# EAGLE schematic iv4_4lw_2.0 (EAGLE 4.91)
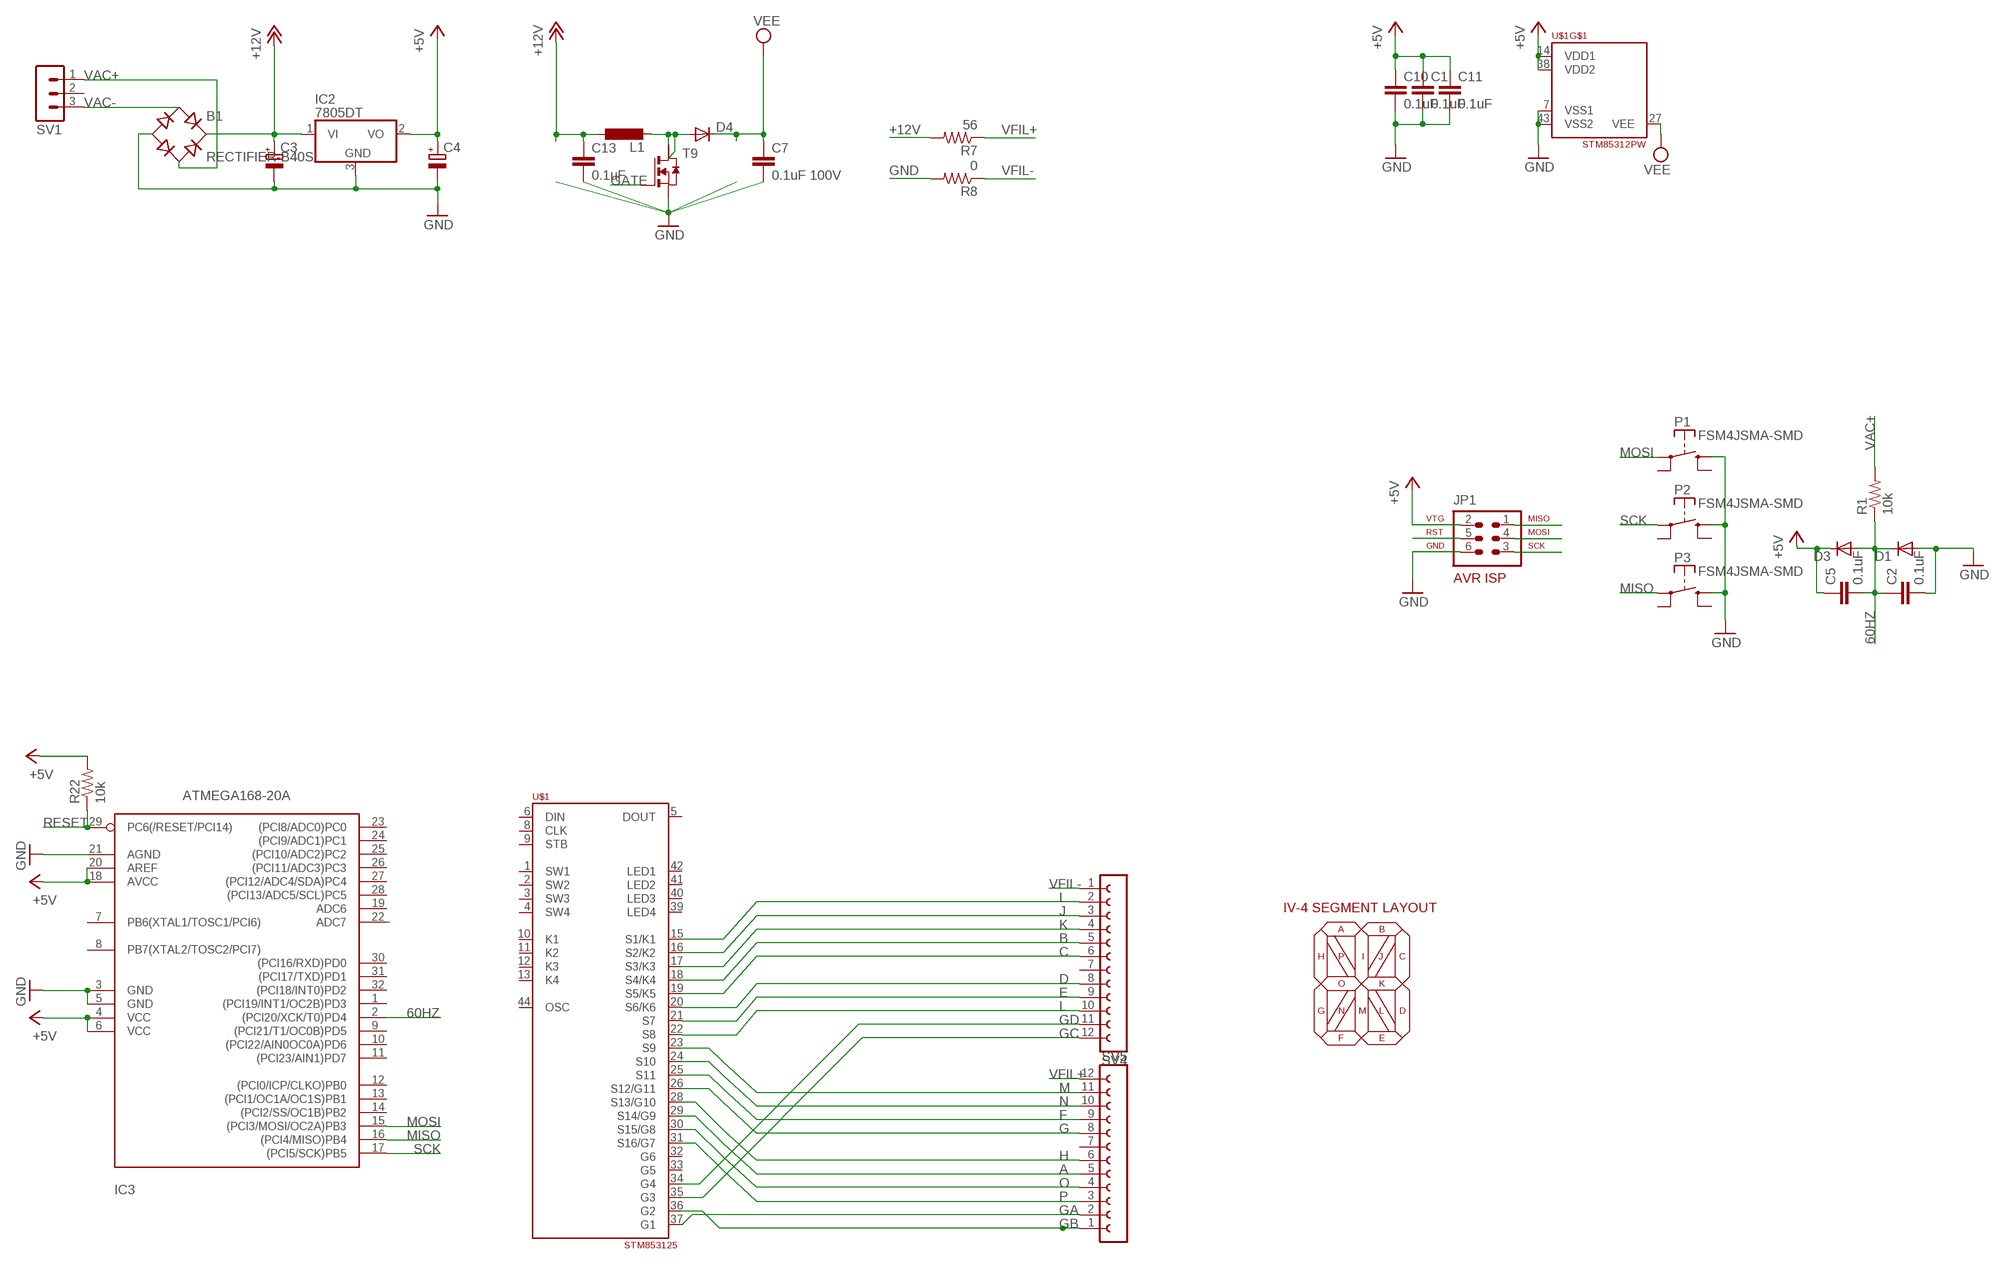
[diagram p0: schematic, sheet 1]

## Parts
B1  RECTIFIER-B40S  [B40S]
C1  0.1uF  C-EUC0805  [C0805]
C2  0.1uF  C-EUC0805  [C0805]
C3  CPOL-EU153CLV-0605  [153CLV-0605]
C4  CPOL-EU153CLV-0807  [153CLV-0807]
C5  0.1uF  C-EUC0805  [C0805]
C7  0.1uF 100V  C-EUC1206  [C1206]
C10  0.1uF  C-EUC0805  [C0805]
C11  0.1uF  C-EUC0805  [C0805]
C13  0.1uF  C-EUC0805  [C0805]
D1  DIODE-SOD123  [SOD123]
D3  DIODE-SOD123  [SOD123]
D4  DIODE-DO214AC  [DO214AC]
IC2  7805DT  [TO252]
IC3  ATMEGA168-20A  [TQFP32-08]
JP1  AVR-ISP-6  [AVR-ISP-6]
L1  DO3316P  [DO3316P]
P1  FSM4JSMA-SMD  [FSM4JSMA-SMD]
P2  FSM4JSMA-SMD  [FSM4JSMA-SMD]
P3  FSM4JSMA-SMD  [FSM4JSMA-SMD]
R1  10k  R-US_R0805  [R0805]
R7  56  R-US_M0805  [M0805]
R8  0  R-US_M0805  [M0805]
R22  10k  R-US_R0805  [R0805]
SV1  MA03-1  [MA03-1]
SV4  FE12-1  [FE12]
SV5  FE12-1  [FE12]
T9  NMOSSOT223  [SOT223]
U$1  STM85312  [PQFP44]

## Nets
60HZ: C2.1 C5.2 D1.C D3.A IC3.2((PCI20/XCK/T0)PD4) R1.1
+5V: C1.1 C4.+ C5.1 C10.1 C11.1 D3.C IC2.2(VO) IC3.4(VCC) IC3.6(VCC) IC3.18(AVCC) IC3.20(AREF) JP1.2 R22.2 U$1.14(VDD1) U$1.38(VDD2)
+12V: B1.+ C3.+ C13.1 IC2.1(VI) L1.2 R7.2
A: SV5.5 U$1.29(S14/G9)
B: SV4.5 U$1.18(S4/K4)
C: SV4.6 U$1.19(S5/K5)
D: SV4.8 U$1.20(S6/K6)
E: SV4.9 U$1.21(S7)
F: SV5.9 U$1.25(S11)
G: SV5.8 U$1.26(S12/G11)
GA: SV5.2 U$1.37(G1)
GATE: T9.1(G)
GB: SV5.1 U$1.36(G2)
GC: SV4.12 U$1.35(G3)
GD: SV4.11 U$1.34(G4)
GND: B1.- C1.2 C2.2 C3.- C4.- C7.2 C10.2 C11.2 C13.2 D1.A IC2.3(GND) IC3.3(GND) IC3.5(GND) IC3.21(AGND) JP1.6 P1.P$3(S) P2.P$3(S) P3.P$3(S) R8.2 T9.3(S) U$1.7(VSS1) U$1.43(VSS2)
H: SV5.6 U$1.28(S13/G10)
I: SV4.2 U$1.15(S1/K1)
J: SV4.3 U$1.16(S2/K2)
K: SV4.4 U$1.17(S3/K3)
L: SV4.10 U$1.22(S8)
M: SV5.11 U$1.23(S9)
MISO: IC3.16((PCI4/MISO)PB4) JP1.1 P3.P$1(P)
MOSI: IC3.15((PCI3/MOSI/OC2A)PB3) JP1.4 P1.P$1(P)
N: SV5.10 U$1.24(S10)
N$1: D4.A L1.1 T9.2(D) T9.4(D2)
O: SV5.4 U$1.30(S15/G8)
P: SV5.3 U$1.31(S16/G7)
RESET: IC3.22(ADC7) IC3.29(PC6(/RESET/PCI14)) JP1.5 R22.1
SCK: IC3.17((PCI5/SCK)PB5) JP1.3 P2.P$1(P)
VAC+: B1.AC2 R1.2 SV1.1
VAC-: B1.AC1 SV1.3
VEE: C7.1 D4.C U$1.27(VEE)
VFIL+: R7.1 SV5.12
VFIL-: R8.1 SV4.1
Unconnected: IC3.1((PCI19/INT1/OC2B)PD3) IC3.7(PB6(XTAL1/TOSC1/PCI6)) IC3.8(PB7(XTAL2/TOSC2/PCI7)) IC3.9((PCI21/T1/OC0B)PD5) IC3.10((PCI22/AIN0OC0A)PD6) IC3.11((PCI23/AIN1)PD7) IC3.12((PCI0/ICP/CLKO)PB0) IC3.13((PCI1/OC1A/OC1S)PB1) IC3.14((PCI2/SS/OC1B)PB2) IC3.19(ADC6) IC3.23((PCI8/ADC0)PC0) IC3.24((PCI9/ADC1)PC1) IC3.25((PCI10/ADC2)PC2) IC3.26((PCI11/ADC3)PC3) IC3.27((PCI12/ADC4/SDA)PC4) IC3.28((PCI13/ADC5/SCL)PC5) IC3.30((PCI16/RXD)PD0) IC3.31((PCI17/TXD)PD1) IC3.32((PCI18/INT0)PD2) P1.P$2(P) P1.P$4(S) P2.P$2(P) P2.P$4(S) P3.P$2(P) P3.P$4(S) SV1.2 SV4.7 SV5.7 U$1.1(SW1) U$1.2(SW2) U$1.3(SW3) U$1.4(SW4) U$1.5(DOUT) U$1.6(DIN) U$1.8(CLK) U$1.9(STB) U$1.10(K1) U$1.11(K2) U$1.12(K3) U$1.13(K4) U$1.32(G6) U$1.33(G5) U$1.39(LED4) U$1.40(LED3) U$1.41(LED2) U$1.42(LED1) U$1.44(OSC)

## Notes on the sheet
- IV-4 SEGMENT LAYOUT
- A | B
- H | P | I | J | C
- O | K
- G | N | M | L | D
- F | E

## Library data of the parts
B1 = rectifier:RECTIFIER-: Rectifier
C1 C2 C5 C7 C10 C11 C13 = rcl:C-EU: CAPACITOR, European symbol
C3 C4 = rcl:CPOL-EU: POLARIZED CAPACITOR, European symbol
D1 D3 D4 = diode:DIODE-: DIODE
IC2 = linear:78*: Positive VOLTAGE REGULATOR Source: http://cache.national.com/ds/LM/LM78L05.pdf http://www.fairchildsemi.com/ds/LM/LM7805.pdf
IC3 = avr:ATMEGA168: MICROCONTROLLER 16 kBytes FLASH 1 kBytes SRAM 512 Bytes EEPROM USART 8-channel 10 bit ADC
JP1 = atmel:AVR-ISP-6: AVR ISP-6 Serial Programming Header
L1 = inductor-coilcraft:DO3316P: COILCRAFT
P1-P3 = switch-misc:FSM4JSMA-SMD: TYCO SWITCH
R1 R7 R8 R22 = rcl:R-US_: RESISTOR, American symbol
SV1 = con-lstb:MA03-1: PIN HEADER
SV4 SV5 = con-lsta:FE12-1: FEMALE HEADER
T9 = zetex:NMOSSOT223: MOS FET
U$1 = st-microelectronics:STM85312